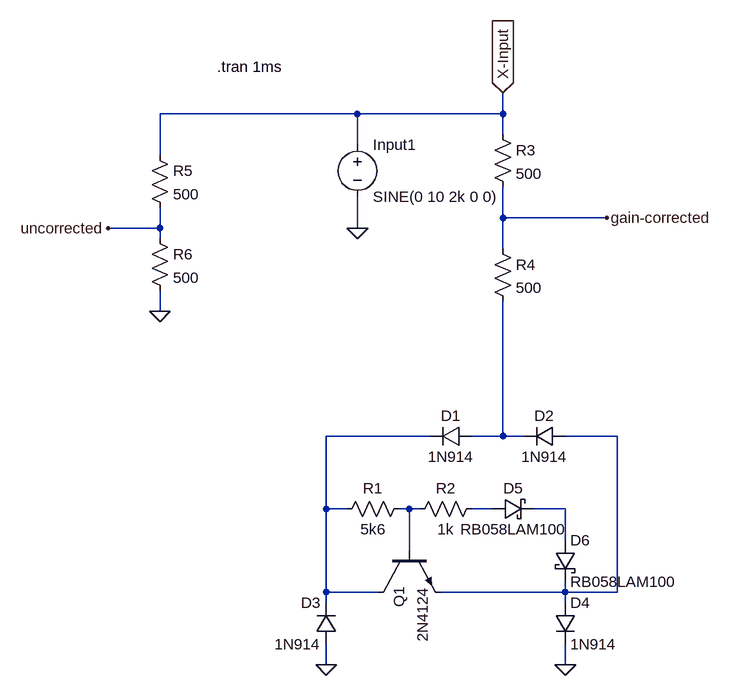
[diagram p0: schematic Gain Correction.asc]
Gain Correction.asc, the LTspice schematic file:
Version 4
SHEET 1 916 680
WIRE 0 -320 -304 -320
WIRE 224 -320 224 -352
WIRE 224 -320 0 -320
WIRE 224 -288 224 -320
WIRE 0 -272 0 -320
WIRE -304 -256 -304 -320
WIRE 224 -160 224 -208
WIRE 384 -160 224 -160
WIRE -304 -144 -304 -176
WIRE -304 -144 -384 -144
WIRE 0 -144 0 -192
WIRE -304 -128 -304 -144
WIRE 224 -112 224 -160
WIRE -304 -16 -304 -48
WIRE 112 176 -48 176
WIRE 224 176 224 -32
WIRE 224 176 176 176
WIRE 256 176 224 176
WIRE 400 176 320 176
WIRE -48 288 -48 176
WIRE -16 288 -48 288
WIRE 80 288 64 288
WIRE 96 288 80 288
WIRE 208 288 176 288
WIRE 320 288 272 288
WIRE 320 336 320 288
WIRE 80 352 80 288
WIRE -48 416 -48 288
WIRE 32 416 -48 416
WIRE 320 416 320 400
WIRE 320 416 128 416
WIRE 400 416 400 176
WIRE 400 416 320 416
WIRE -48 432 -48 416
WIRE 320 432 320 416
WIRE -48 528 -48 496
WIRE 320 528 320 496
FLAG -48 528 0
FLAG 320 528 0
FLAG 224 -352 X-Input
IOPIN 224 -352 In
FLAG 0 -144 0
FLAG 384 -160 gain-corrected
FLAG -304 -16 0
FLAG -384 -144 uncorrected
SYMBOL diode 176 160 R90
WINDOW 0 0 32 VBottom 2
WINDOW 3 32 32 VTop 2
SYMATTR InstName D1
SYMATTR Value 1N914
SYMBOL diode 320 160 R90
WINDOW 0 0 32 VBottom 2
WINDOW 3 32 32 VTop 2
SYMATTR InstName D2
SYMATTR Value 1N914
SYMBOL diode -32 496 R180
WINDOW 0 24 64 Left 2
WINDOW 3 24 0 Left 2
SYMATTR InstName D3
SYMATTR Value 1N914
SYMBOL diode 304 432 R0
SYMATTR InstName D4
SYMATTR Value 1N914
SYMBOL schottky 208 304 R270
WINDOW 0 32 32 VTop 2
WINDOW 3 0 32 VBottom 2
SYMATTR InstName D5
SYMATTR Value RB058LAM100
SYMATTR Description Diode
SYMATTR Type diode
SYMBOL schottky 304 336 R0
SYMATTR InstName D6
SYMATTR Value RB058LAM100
SYMATTR Description Diode
SYMATTR Type diode
SYMBOL npn 32 352 M90
SYMATTR InstName Q1
SYMATTR Value 2N4124
SYMBOL res 80 272 R90
WINDOW 0 0 56 VBottom 2
WINDOW 3 32 56 VTop 2
SYMATTR InstName R1
SYMATTR Value 5k6
SYMBOL res 192 272 R90
WINDOW 0 0 56 VBottom 2
WINDOW 3 32 56 VTop 2
SYMATTR InstName R2
SYMATTR Value 1k
SYMBOL res 208 -304 R0
SYMATTR InstName R3
SYMATTR Value 500
SYMBOL res 208 -128 R0
SYMATTR InstName R4
SYMATTR Value 500
SYMBOL voltage 0 -288 R0
SYMATTR InstName Input1
SYMATTR Value SINE(0 10 2k 0 0)
SYMBOL res -320 -272 R0
SYMATTR InstName R5
SYMATTR Value 500
SYMBOL res -320 -144 R0
SYMATTR InstName R6
SYMATTR Value 500
TEXT -216 -392 Left 2 !.tran 1ms

The netlist it stands for:
* Gain Correction.asc
D1 N002 N001 1N914
D2 N003 N002 1N914
D3 0 N001 1N914
D4 N003 0 1N914
D5 N005 N006 RB058LAM100
D6 N006 N003 RB058LAM100
Q1 N001 N004 N003 0 2N4124
R1 N004 N001 5k6
R2 N005 N004 1k
R3 X-Input gain-corrected 500
R4 gain-corrected N002 500
V§Input1 X-Input 0 SINE(0 10 2k 0 0)
R5 X-Input uncorrected 500
R6 uncorrected 0 500
.model D D
.lib standard.dio
.model NPN NPN
.model PNP PNP
.lib standard.bjt
.tran 1ms
.backanno
.end